# Altium schematic sheet CAN_interface.SchDoc
size A4
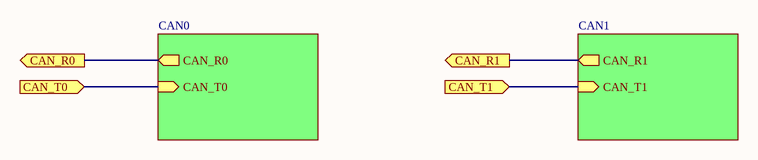
[diagram p0: CAN_interface.SchDoc]

## Sub-sheets
CAN0 = CAN0.SchDoc: CAN_R0 (out), CAN_T0 (in)
CAN1 = CAN1.SchDoc: CAN_R1 (out), CAN_T1 (in)

## Ports
CAN_R0 (out), CAN_R1 (out), CAN_T0 (in), CAN_T1 (in)

## Nets
CAN_R0: port CAN_R0, sheet CAN0/CAN_R0
CAN_R1: port CAN_R1, sheet CAN1/CAN_R1
CAN_T0: port CAN_T0, sheet CAN0/CAN_T0
CAN_T1: port CAN_T1, sheet CAN1/CAN_T1